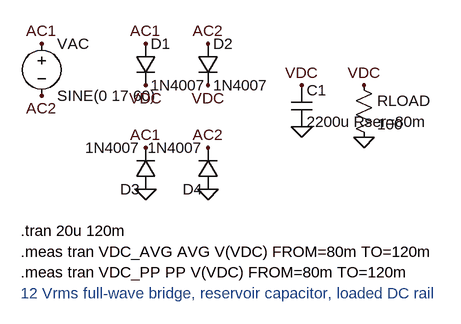
[diagram p0: schematic 18_full_bridge_power_supply.asc]
18_full_bridge_power_supply.asc, the LTspice schematic file:
Version 4
SHEET 1 1040 700
FLAG 80 96 AC1
FLAG 80 176 AC2
FLAG 240 96 AC1
FLAG 240 160 VDC
FLAG 336 96 AC2
FLAG 336 160 VDC
FLAG 240 320 0
FLAG 240 256 AC1
FLAG 336 320 0
FLAG 336 256 AC2
FLAG 480 160 VDC
FLAG 480 224 0
FLAG 576 160 VDC
FLAG 576 240 0
SYMBOL voltage 80 80 R0
SYMATTR InstName VAC
SYMATTR Value SINE(0 17 60)
SYMBOL diode 224 96 R0
SYMATTR InstName D1
SYMATTR Value 1N4007
SYMBOL diode 320 96 R0
SYMATTR InstName D2
SYMATTR Value 1N4007
SYMBOL diode 256 320 R180
SYMATTR InstName D3
SYMATTR Value 1N4007
SYMBOL diode 352 320 R180
SYMATTR InstName D4
SYMATTR Value 1N4007
SYMBOL cap 464 160 R0
SYMATTR InstName C1
SYMATTR Value 2200u Rser=80m
SYMBOL res 560 144 R0
SYMATTR InstName RLOAD
SYMATTR Value 100
TEXT 48 384 Left 2 !.tran 20u 120m
TEXT 48 416 Left 2 !.meas tran VDC_AVG AVG V(VDC) FROM=80m TO=120m
TEXT 48 448 Left 2 !.meas tran VDC_PP PP V(VDC) FROM=80m TO=120m
TEXT 48 480 Left 2 ;12 Vrms full-wave bridge, reservoir capacitor, loaded DC rail

The netlist it stands for:
* 18_full_bridge_power_supply.asc
VAC AC1 AC2 SINE(0 17 60)
D1 AC1 VDC 1N4007
D2 AC2 VDC 1N4007
D3 0 AC1 1N4007
D4 0 AC2 1N4007
C1 VDC 0 2200u Rser=80m
RLOAD VDC 0 100
.model D D
.lib standard.dio
.tran 20u 120m
.meas tran VDC_AVG AVG V(VDC) FROM=80m TO=120m
.meas tran VDC_PP PP V(VDC) FROM=80m TO=120m
* 12 Vrms full-wave bridge, reservoir capacitor, loaded DC rail
.backanno
.end